# EAGLE design op-synth 1.0 (EAGLE 6.6.0)
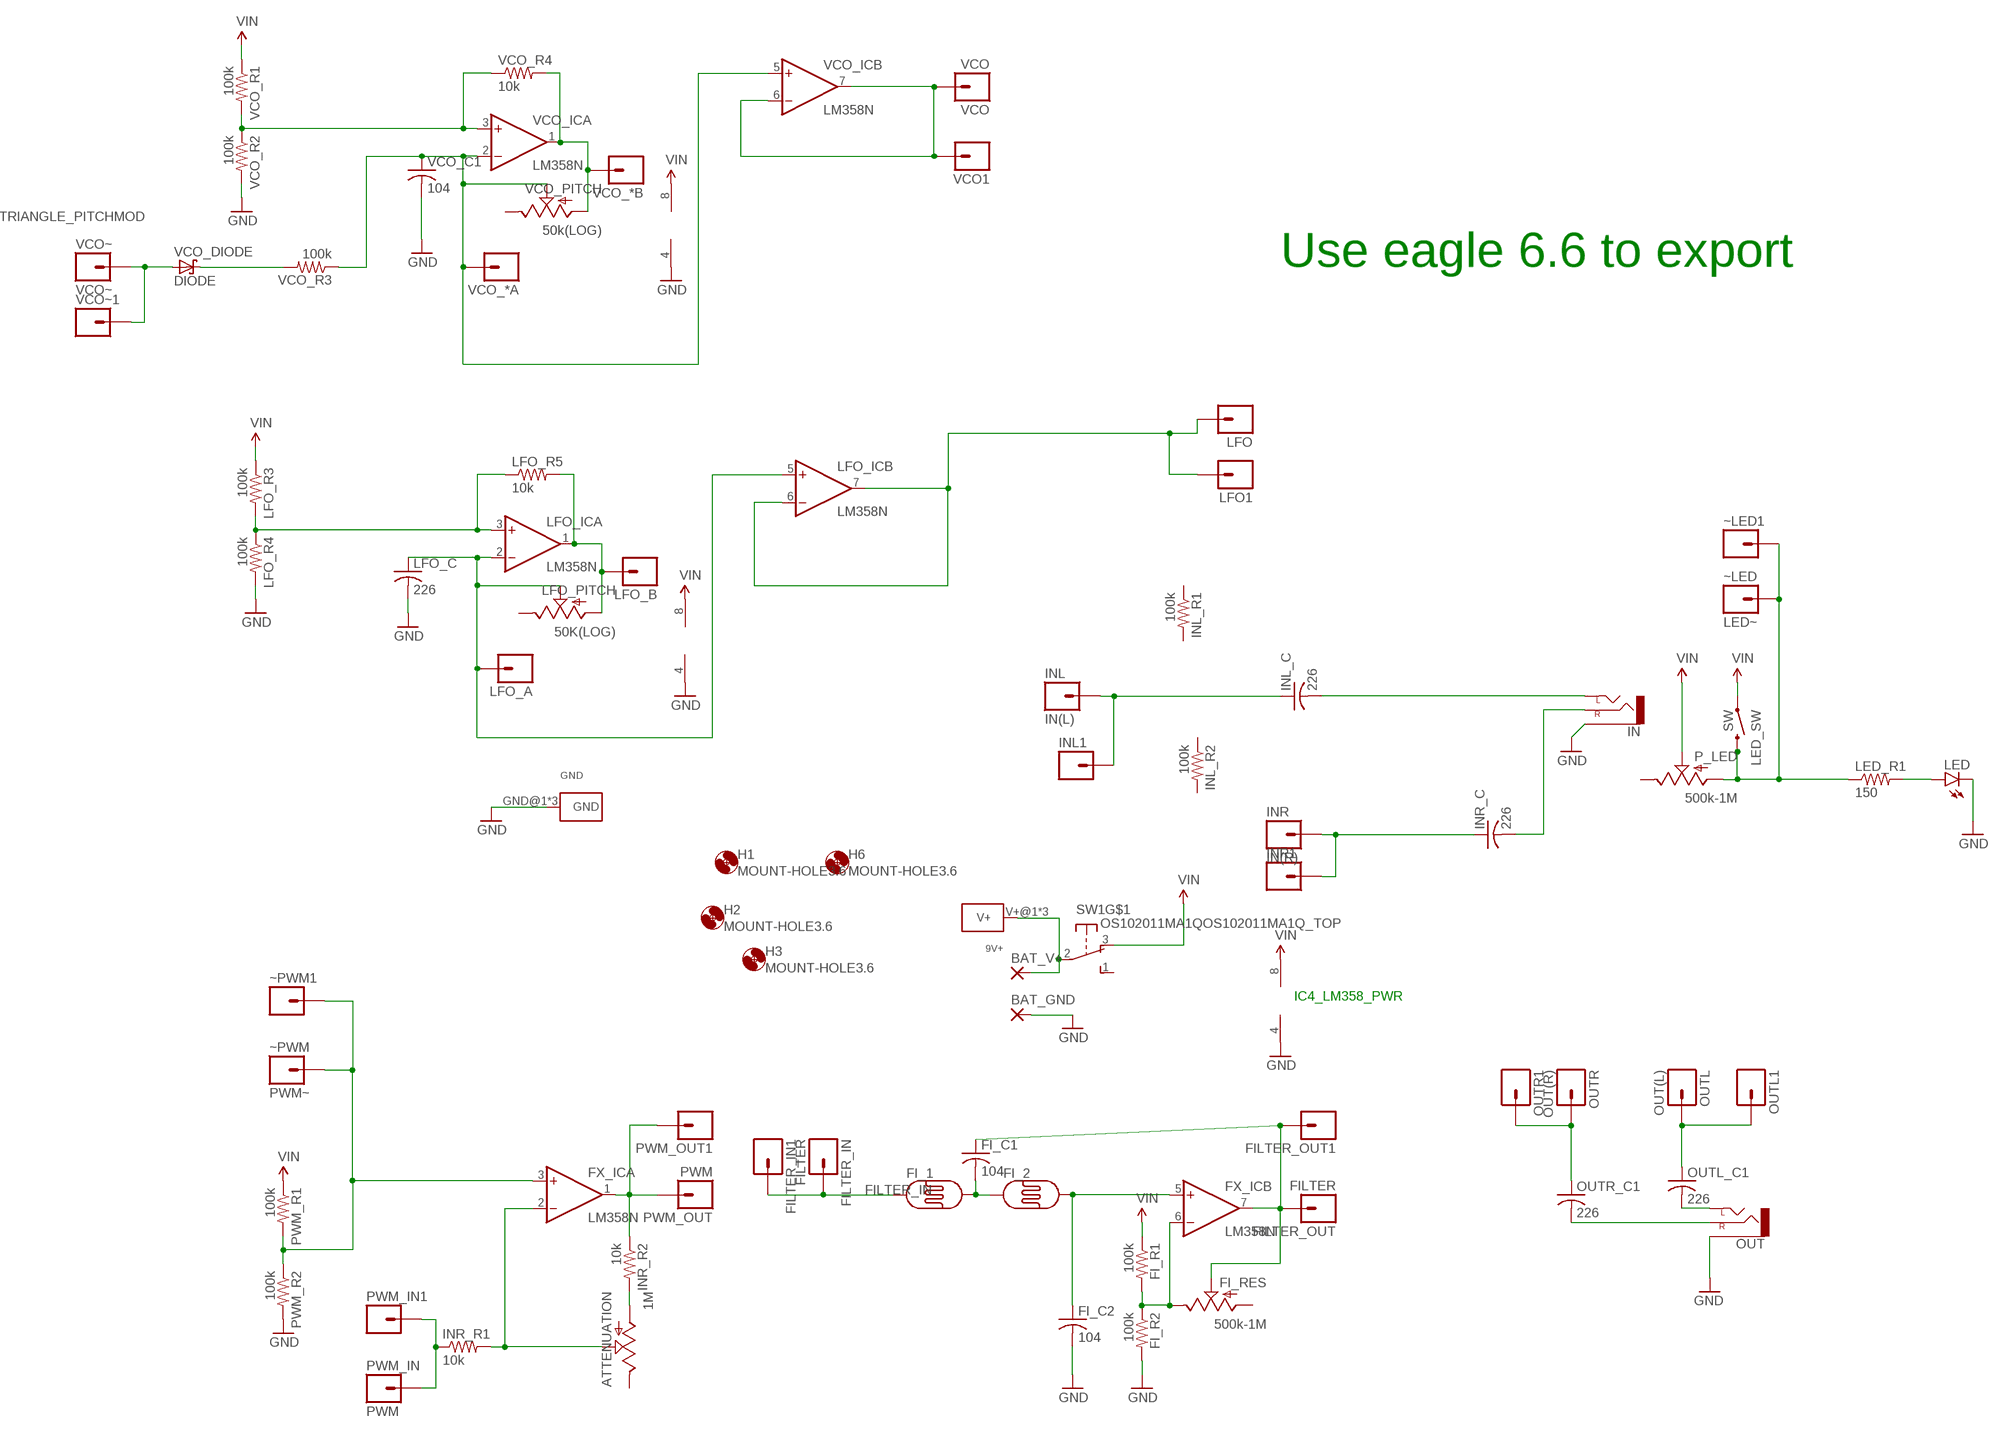
[diagram p0: schematic, sheet 1]

## Parts
9V+  KEYSTONE-629+  [KEYSTONE_BATTAERY_TERMINAL-629+]
ATTENUATION  1M  POTTRIM  [TRIM_POT]
BAT_GND  3,81/1,4  [3,81/1,4]
BAT_V+  3,81/1,4  [3,81/1,4]
FI_1  PHOTOCELLPTH  [PHOTOCELL]
FI_2  PHOTOCELLPTH  [PHOTOCELL]
FI_C1  104  C-US050-024X044  [C050-024X044]
FI_C2  104  C-US050-024X044  [C050-024X044]
FI_R1  100k  R-US_0204/7  [0204/7]
FI_R2  100k  R-US_0204/7  [0204/7]
FI_RES  500k-1M  POT  [ALPS_POT]
FILTER_IN  FILTER  HEADER-1X1  [1X01_SIDE_NAME]
FILTER_IN1  HEADER-1X1  [1X01_SIDE_NAME]
FILTER_OUT  FILTER  HEADER-1X1  [1X01_SIDE_NAME]
FILTER_OUT1  HEADER-1X1  [1X01_SIDE_NAME]
FX_IC  LM358N  [DIL08]
GND  KEYSTONE-629  [KEYSTONE_AA_AAA_BATTERY_TERMINAL-629]
H1  MOUNT-HOLE3.6  [3,6]
H2  MOUNT-HOLE3.6  [3,6]
H3  MOUNT-HOLE3.6  [3,6]
H6  MOUNT-HOLE3.6  [3,6]
IN  AUDIO-JACKPTH  [AUDIO-JACK]
INL  IN(L)  HEADER-1X1  [1X01_SIDE_NAME]
INL1  HEADER-1X1  [1X01_SIDE_NAME]
INL_C  226  C-US050-024X044  [C050-024X044]
INL_R1  100k  R-US_0204/7  [0204/7]
INL_R2  100k  R-US_0204/7  [0204/7]
INR  IN(R)  HEADER-1X1  [1X01_SIDE_NAME]
INR1  HEADER-1X1  [1X01_SIDE_NAME]
INR_C  226  C-US050-024X044  [C050-024X044]
INR_R1  10k  R-US_0204/7  [0204/7]
INR_R2  10k  R-US_0204/7  [0204/7]
LED  LED5MM  [LED5MM]
LED_R1  150  R-US_0204/7  [0204/7]
LED_SW  SW  SWITCH-MOMENTARY-212MM  [TACTILE-PTH-12MM]
LFO  HEADER-1X1  [1X01_SIDE_NAME]
LFO1  HEADER-1X1  [1X01_SIDE_NAME]
LFO_A  HEADER-1X1  [1X01_SIDE_NAME]
LFO_B  HEADER-1X1  [1X01_SIDE_NAME]
LFO_C  226  C-US050-024X044  [C050-024X044]
LFO_IC  LM358N  [DIL08]
LFO_PITCH  50K(LOG)  POT  [ALPS_POT]
LFO_R3  100k  R-US_0204/7  [0204/7]
LFO_R4  100k  R-US_0204/7  [0204/7]
LFO_R5  10k  R-US_0204/7  [0204/7]
OUT  AUDIO-JACKPTH  [AUDIO-JACK]
OUTL  OUT(L)  HEADER-1X1  [1X01_SIDE_NAME]
OUTL1  HEADER-1X1  [1X01_SIDE_NAME]
OUTL_C1  226  C-US050-024X044  [C050-024X044]
OUTR  OUT(R)  HEADER-1X1  [1X01_SIDE_NAME]
OUTR1  HEADER-1X1  [1X01_SIDE_NAME]
OUTR_C1  226  C-US050-024X044  [C050-024X044]
P_LED  500k-1M  POT  [ALPS_POT]
PWM_IN  PWM  HEADER-1X1  [1X01_SIDE_NAME]
PWM_IN1  HEADER-1X1  [1X01_SIDE_NAME]
PWM_OUT  PWM  HEADER-1X1  [1X01_SIDE_NAME]
PWM_OUT1  HEADER-1X1  [1X01_SIDE_NAME]
PWM_R1  100k  R-US_0204/7  [0204/7]
PWM_R2  100k  R-US_0204/7  [0204/7]
SW1  OS102011MA1QOS102011MA1Q_TOP  [OS102011MA1Q]
VCO  VCO  HEADER-1X1  [1X01_SIDE_NAME]
VCO1  HEADER-1X1  [1X01_SIDE_NAME]
VCO_*A  HEADER-1X1  [1X01_SIDE_NAME]
VCO_*B  HEADER-1X1  [1X01_SIDE_NAME]
VCO_C1  104  C-US050-024X044  [C050-024X044]
VCO_DIODE  DIODE  SCHOTTKY-DIODEDO41-7  [DO41-7]
VCO_IC  LM358N  [DIL08]
VCO_PITCH  50k(LOG)  POT  [ALPS_POT]
VCO_R1  100k  R-US_0204/7  [0204/7]
VCO_R2  100k  R-US_0204/7  [0204/7]
VCO_R3  100k  R-US_0204/7  [0204/7]
VCO_R4  10k  R-US_0204/7  [0204/7]
VCO~  VCO~  HEADER-1X1  [1X01_SIDE_NAME]
VCO~1  HEADER-1X1  [1X01_SIDE_NAME]
~LED  LED~  HEADER-1X1  [1X01_SIDE_NAME]
~LED1  HEADER-1X1  [1X01_SIDE_NAME]
~PWM  PWM~  HEADER-1X1  [1X01_SIDE_NAME]
~PWM1  HEADER-1X1  [1X01_SIDE_NAME]

## Nets
FILTER_IN: FI_1.1 FILTER_IN1.1 FILTER_IN.1
FILTER_OUT: FI_C1.1 FI_RES.P$2(S) FILTER_OUT1.1 FILTER_OUT.1 FX_IC.7(B:OUT)
GND: BAT_GND.1(P) FI_C2.2 FI_R2.2 FX_IC.4(P:V-) GND.GND@1(GND) GND.GND@2(GND) GND.GND@3(GND) IN.SLEEVE LED.K(C) LFO_C.2 LFO_IC.4(P:V-) LFO_R4.2 OUT.SLEEVE PWM_R2.2 VCO_C1.2 VCO_IC.4(P:V-) VCO_R2.2
LFO: LFO1.1 LFO.1 LFO_IC.6(B:-IN) LFO_IC.7(B:OUT)
MOD_IN: INR_R1.1 PWM_IN1.1 PWM_IN.1
N$1: 9V+.V+@1(V+) 9V+.V+@2(V+) 9V+.V+@3(V+) BAT_V+.1(P) SW1.2(P)
N$2: VCO_DIODE.C VCO_R3.2
N$3: ATTENUATION.3(A) INR_R2.2
N$4: VCO_IC.3(A:+IN) VCO_R1.2 VCO_R2.1 VCO_R4.1
N$5: FX_IC.3(A:+IN) PWM_R1.2 PWM_R2.1 ~PWM1.1 ~PWM.1
N$6: LED.A LED_R1.2
N$7: FI_2.2 FI_C2.1 FX_IC.5(B:+IN)
N$8: FI_1.2 FI_2.1 FI_C1.2
N$9: OUTR1.1 OUTR.1 OUTR_C1.1
N$10: VCO_*B.1 VCO_IC.1(A:OUT) VCO_PITCH.P$3(A) VCO_R4.2
N$11: OUT.TIP(LEFT) OUTL_C1.2
N$12: OUTL1.1 OUTL.1 OUTL_C1.1
N$13: LED_R1.1 LED_SW.3 P_LED.P$3(A) ~LED1.1 ~LED.1
N$14: INR1.1 INR.1 INR_C.1
N$15: IN.RING(RIGHT) INR_C.2
N$16: FI_R1.2 FI_R2.1 FI_RES.P$1(E) FX_IC.6(B:-IN)
N$17: LFO_IC.3(A:+IN) LFO_R3.2 LFO_R4.1 LFO_R5.1
N$18: VCO_*A.1 VCO_C1.1 VCO_IC.2(A:-IN) VCO_IC.5(B:+IN) VCO_PITCH.P$2(S) VCO_R3.1
N$19: INL1.1 INL.1 INL_C.1
N$20: IN.TIP(LEFT) INL_C.2
N$21: LFO_B.1 LFO_IC.1(A:OUT) LFO_PITCH.P$3(A) LFO_R5.2
N$22: LFO_A.1 LFO_C.1 LFO_IC.2(A:-IN) LFO_IC.5(B:+IN) LFO_PITCH.P$2(S)
N$23: VCO1.1 VCO.1 VCO_IC.6(B:-IN) VCO_IC.7(B:OUT)
N$24: OUT.RING(RIGHT) OUTR_C1.2
N$25: ATTENUATION.1(S) FX_IC.2(A:-IN) INR_R1.2
N$26: FX_IC.1(A:OUT) INR_R2.1 PWM_OUT1.1 PWM_OUT.1
TRIANGLE_PITCHMOD: VCO_DIODE.A VCO~1.1 VCO~.1
VIN: FI_R1.1 FX_IC.8(P:V+) LED_SW.1 LFO_IC.8(P:V+) LFO_R3.1 P_LED.P$2(S) PWM_R1.1 SW1.3(O) VCO_IC.8(P:V+) VCO_R1.1
Unconnected: ATTENUATION.2(E) FI_RES.P$3(A) INL_R1.1 INL_R1.2 INL_R2.1 INL_R2.2 LFO_PITCH.P$1(E) P_LED.P$1(E) SW1.1(S) SW1.MT1(MT) SW1.MT2(MT) VCO_PITCH.P$1(E)

## Notes on the sheet
- Use eagle 6.6 to export
- IC4_LM358_PWR

## Library data of the parts
9V+ = kanflo:KEYSTONE-629+
ATTENUATION = SparkFun-Electromechanical:POT
BAT_GND BAT_V+ = wirepad:3,81/1,4: THROUGH-HOLE PAD
FI_1 FI_2 = SparkFun-Sensors:PHOTOCELL: CdS photoresistor. This is a low cost way to detect light levels. Resistance decreases with more incoming light. SparkFun SKU: SEN-09088
FI_C1 FI_C2 LFO_C = resistor:C-US: CAPACITOR, American symbol
FI_R1 FI_R2 INL_R1 INL_R2 INR_R1 INR_R2 LED_R1 LFO_R3-LFO_R5 PWM_R1 PWM_R2 VCO_R1-VCO_R4 = resistor:R-US_: RESISTOR, American symbol
FI_RES LFO_PITCH P_LED VCO_PITCH = SparkFun-Electromechanical:POT; PROD_ID: RES-09177
FILTER_IN FILTER_IN1 FILTER_OUT FILTER_OUT1 INL INL1 INR INR1 LFO LFO1 LFO_A LFO_B OUTL OUTL1 OUTR OUTR1 PWM_IN PWM_IN1 PWM_OUT PWM_OUT1 VCO VCO1 VCO_*A VCO_*B VCO~ VCO~1 ~LED ~LED1 ~PWM ~PWM1 = TOF:HEADER-1X1: Header 1 Standard 1-pin 0.1" header. Use with straight break away headers (SKU : PRT-00116), right angle break away headers (PRT-00553), swiss pins (PRT-00743), machine pins (PRT-00117), and female headers (PRT-00115).
FX_IC LFO_IC VCO_IC = linear:LM358: OP AMP also LM158; LM258; LM2904 Source: http://cache.national.com/ds/LM/LM158.pdf
GND = kanflo:KEYSTONE-629: Keystone 629 PCB Mount Battery Contact for 1 (AA), 1 (AAA), 1 (N), Coil Spring Contact Links Data sheet <http://docs-europe.electrocomponents.com/webdocs/002e/0900766b8002ef6f.pdf> RS Online <http://se.rs-online.com/web/p/battery-holders-mounts/2050057/>
H1-H3 H6 = holes:MOUNT-HOLE: MOUNTING HOLE with drill center marker
IN OUT = SparkFun-Connectors:AUDIO-JACK: 3.5mm Audio Jack Simple 3.5mm common PCB mount audio jack. Variant PTH is our storefront SKU PRT-08032
INL_C INR_C OUTL_C1 OUTR_C1 VCO_C1 = adafruit:C-US: CAPACITOR, American symbol
LED = SparkFun-LED:LED: LEDs Standard schematic elements and footprints for 5mm, 3mm, 1206, and 0603 sized LEDs. 5mm - Spark Fun Electronics SKU : COM-00529 (and others)
LED_SW = SparkFun-Electromechanical:SWITCH-MOMENTARY-2: Various NO switches- pushbuttons, reed, etc; PROD_ID: SWCH-09185
SW1 = TOF:OS102011MA1Q: OS10201MA1Q through-hole right angle switch http://www.ladyada.net/library/eagle
VCO_DIODE = adafruit:SCHOTTKY-DIODE: Schottky Diode

## Board
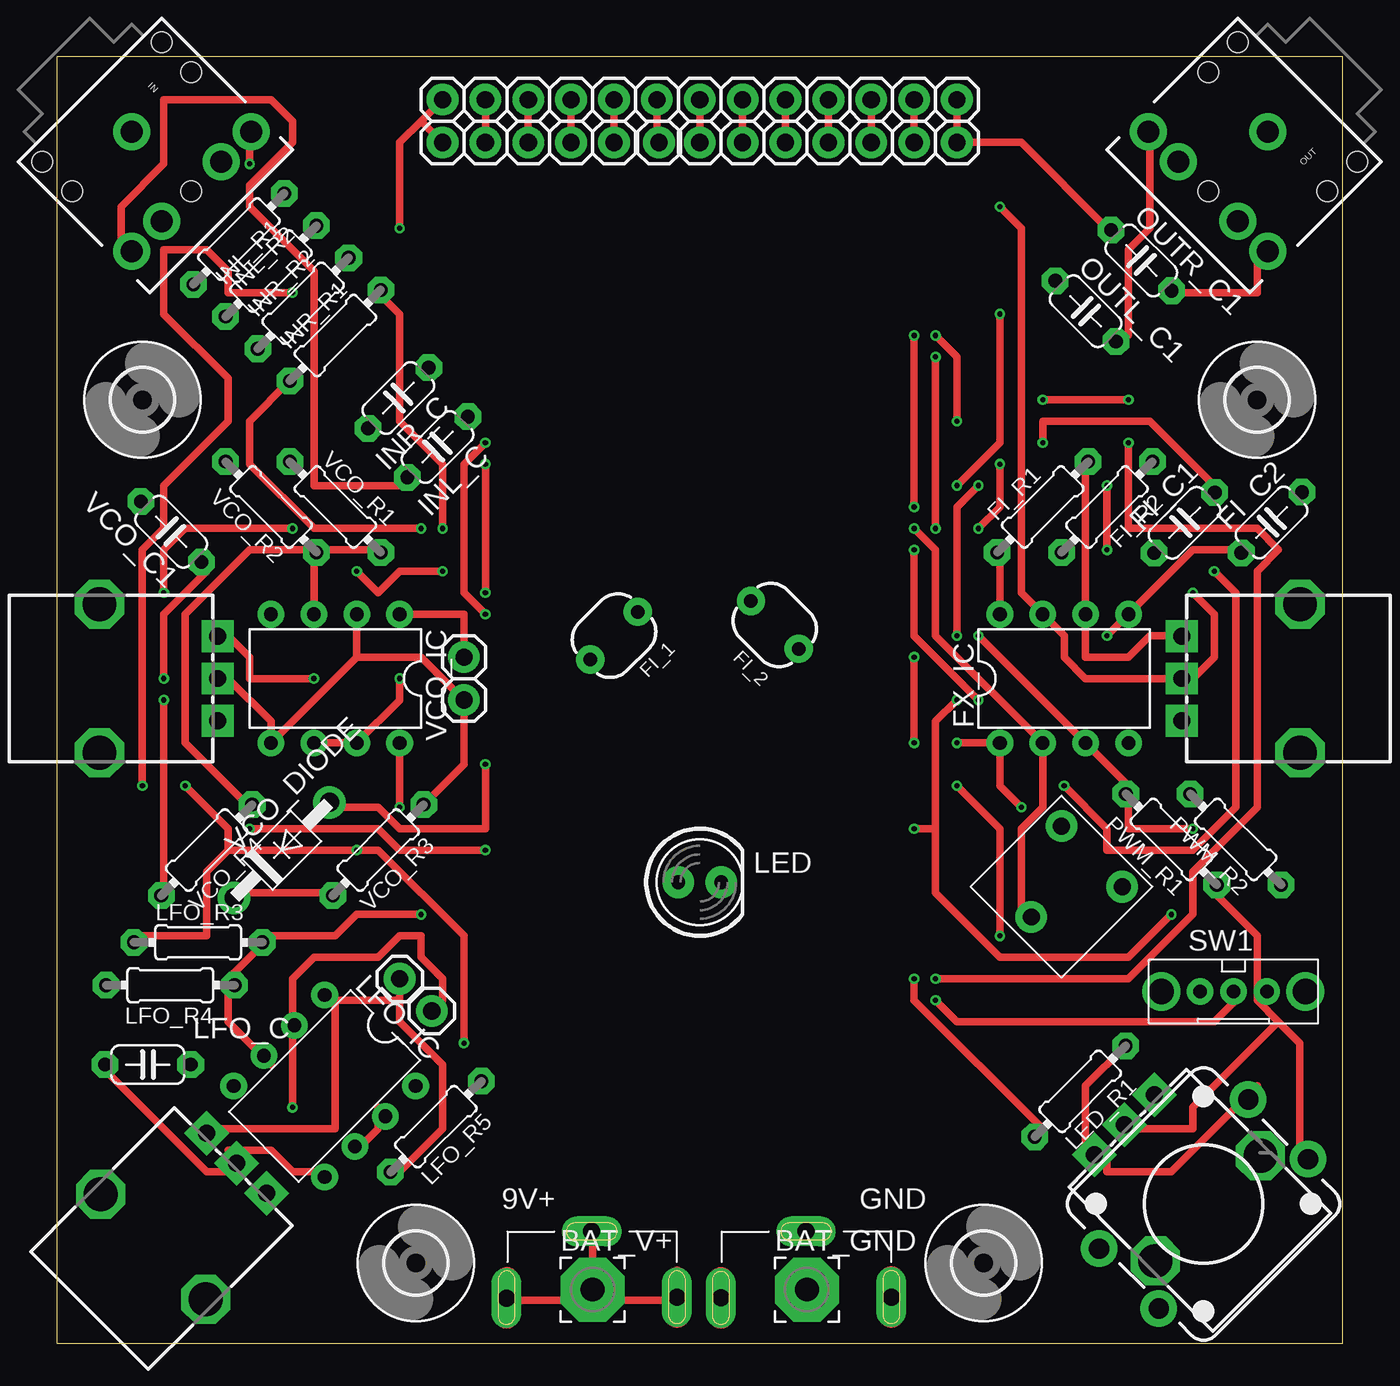
[diagram p1: board, top side]
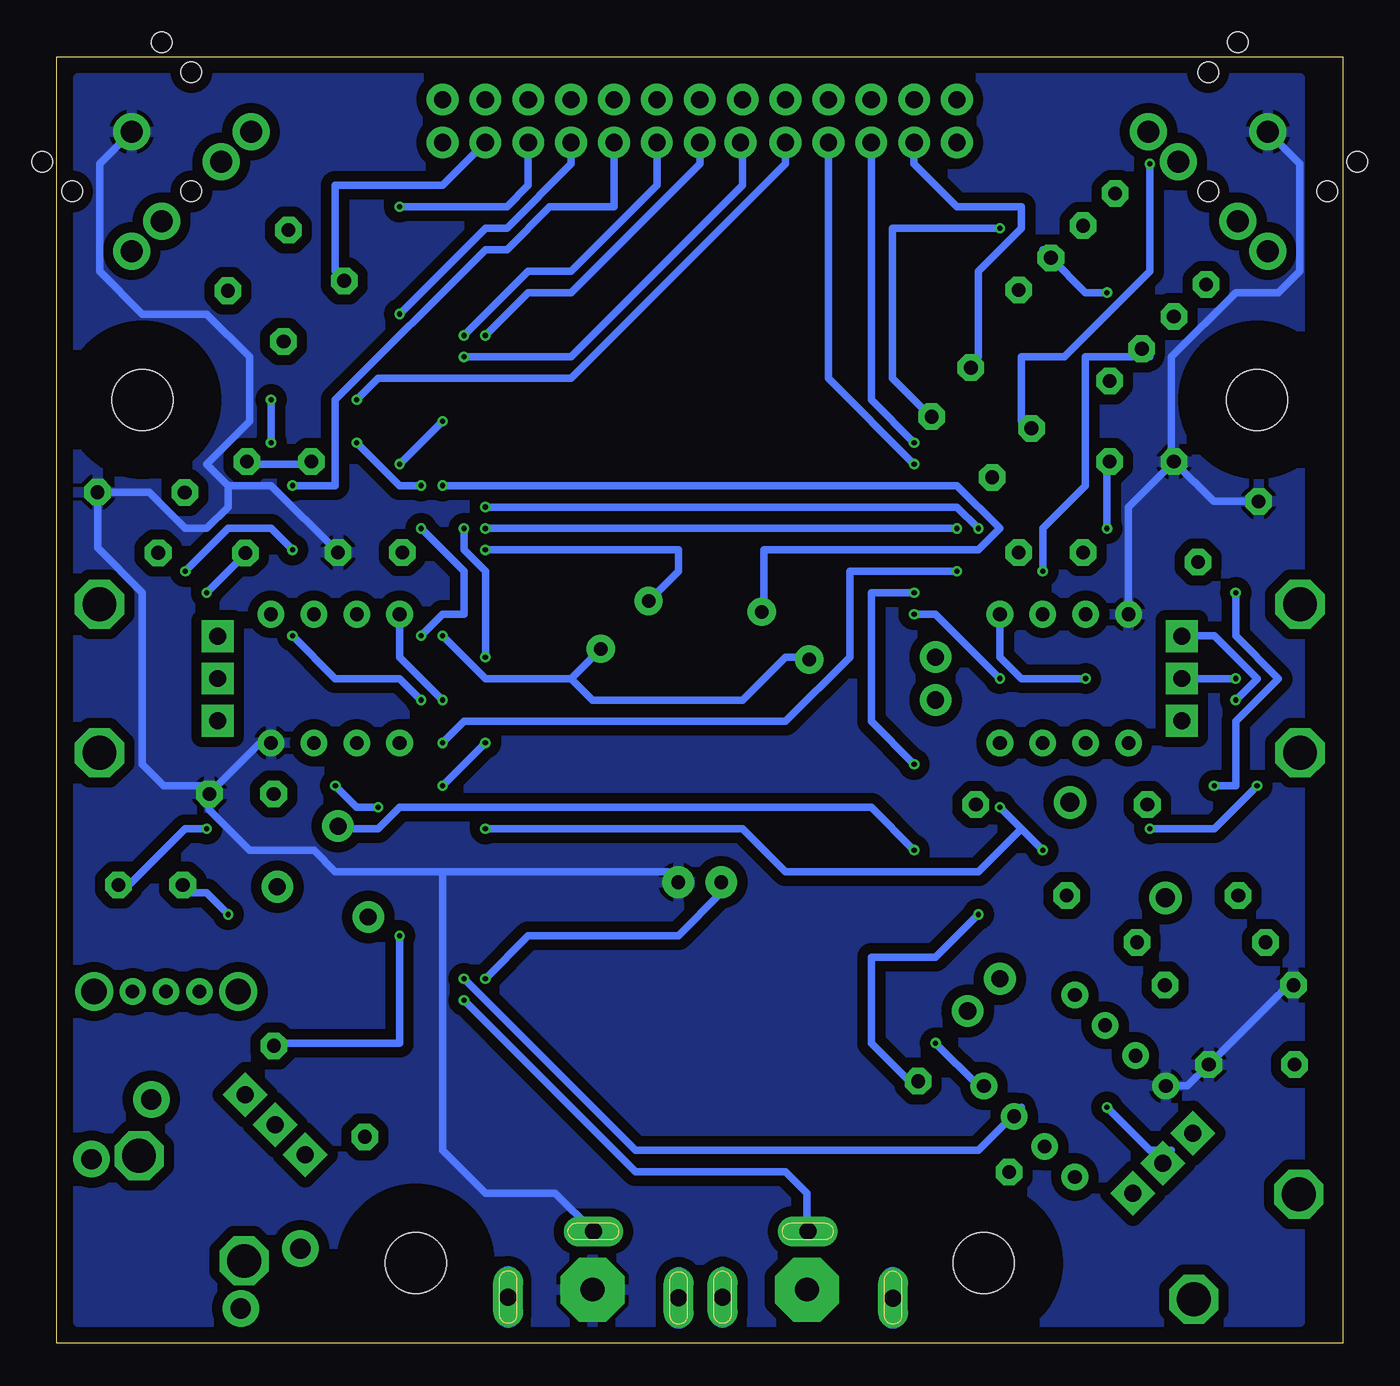
[diagram p2: board, bottom side, seen from below]

Size 76.2 x 76.2 mm. Coordinates in mm from the lower left corner, seen from the top.
Outline: 0,0 76.2,0 76.2,76.2 0,76.2 0,0
Copper layers (1*16): Top 0.035mm / dielectric 1.5mm / Bottom 0.035mm
Design rules "EagleRules *": minimum track width 18mil, minimum drill 12mil, track to track 7mil, track to pad 12mil, pad to pad 12mil, via to via 7mil, smd to smd 0mil, copper to edge 25mil, drill to drill 10mil, minimum pad ring 15mil, minimum via ring 6mil, stop-mask expansion 2mil, vias tented up to drill 25mil, thermal gap 10mil
tRestrict: area 21.6,61 to 54.6,69.8; area 26.7,7.6 to 50.2,61

### Footprints (pad centres in the part's own frame; a part is rotated, then mirrored left to right if it is on the bottom)
KEYSTONE_BATTAERY_TERMINAL-629+ = drill 1 pad 1.5 long: V+@1 5,-0.449; V+@2 -0.05,3.45; V+@3 -5.1,-0.499
TRIM_POT = drill 1 pad 1.88: 1 5.08,0; 2 0,2.54; 3 0,-2.54
3,81/1,4 = drill 1.397 pad 3.81 octagon: 1 0,0
PHOTOCELL = drill 0.8 pad 1.676: 1 -2,0; 2 2,0
C050-024X044 = drill 0.813 octagon: 1 -2.54,0; 2 2.54,0
0204/7 = drill 0.813 octagon: 1 -3.81,0; 2 3.81,0
ALPS_POT = drill 1 pad 1.88 square: P$1 7,-2.5; P$2 7,0; P$3 7,2.5 | drill 2 octagon: P$4 0,-4.4; P$5 0,4.4
1X01_SIDE_NAME = drill 1.016 pad 1.88: 1 0,0
DIL08 = drill 0.813 pad 1.27: 1 -3.81,-3.81; 2 -1.27,-3.81; 3 1.27,-3.81; 4 3.81,-3.81; 5 3.81,3.81; 6 1.27,3.81; 7 -1.27,3.81; 8 -3.81,3.81
KEYSTONE_AA_AAA_BATTERY_TERMINAL-629 = drill 1 pad 1.5 long: GND@1 5,-0.436; GND@2 -0.05,3.45; GND@3 -5.1,-0.486
3,6 = hole 3.6: 0,0
AUDIO-JACK = drill 1.3 pad 2.184: RING 5,5; RSH 5,2.5; SLEEVE 0,0; TIP 5,-5; TSH 5,-2.5 | hole 1.2: 0,5; -2.5,5; -2.5,-5; 0,-5; 5,0
LED5MM = drill 0.813 pad 1.88: A -1.27,0; K 1.27,0
TACTILE-PTH-12MM = drill 1.2 pad 2.159: 1 6.25,-2.5; 2 -6.25,-2.5; 3 6.25,2.5; 4 -6.25,2.5
OS102011MA1Q = drill 0.8 pad 1.422: 1 -1.981,0; 2 0,0; 3 1.981,0 | drill 1.5 pad 2.184: MT1 -4.267,0; MT2 4.267,0
DO41-7 = drill 1.118 pad 1.93: A 4,0; C -4,0

### Placement (x,y rotation side)
9V+  31.75,3.17 0 top
ATTENUATION  61.33,28.84 225 top
BAT_GND  44.45,3.17 0 top
BAT_V+  31.75,3.17 0 top
FI_1  33.02,41.91 225 top
FI_2  42.55,42.55 135 top
FI_C1  66.82,48.59 45 top
FI_C2  71.98,48.61 45 top
FI_R1  58.42,49.53 45 top
FI_R2  62.23,49.53 225 top
FI_RES  73.66,39.37 180 top
FILTER_IN  45.72,71.12 270 top
FILTER_IN1  45.72,73.66 90 top
FILTER_OUT  48.26,71.12 270 top
FILTER_OUT1  48.26,73.66 90 top
FX_IC  59.69,39.37 0 top
GND  44.45,3.17 0 top
H1  71.12,55.88 0 top
H2  21.27,4.76 0 top
H3  54.93,4.76 0 top
H6  5.08,55.88 0 top
IN  4.45,71.75 315 top
INL  22.86,71.12 270 top
INL1  22.86,73.66 90 top
INL_C  22.56,53.09 225 top
INL_R1  12.7,63.5 45 top
INL_R2  10.79,65.41 225 top
INR  25.4,71.12 270 top
INR1  25.4,73.66 90 top
INR_C  20.24,55.99 225 top
INR_R1  16.51,59.69 45 top
INR_R2  14.61,61.59 45 top
LED  38.1,27.3 0 top
LED_R1  60.64,14.92 225 top
LED_SW  67.94,8.26 45 top
LFO  33.02,71.12 270 top
LFO1  33.02,73.66 0 top
LFO_A  22.23,19.68 45 top
LFO_B  20.32,21.59 315 top
LFO_C  5.4,16.51 0 top
LFO_IC  15.88,15.24 225 top
LFO_PITCH  5.71,5.71 45 top
LFO_R3  8.38,23.75 0 top
LFO_R4  6.73,21.21 180 top
LFO_R5  22.47,12.83 225 top
OUT  71.75,71.75 225 top
OUTL  50.8,71.12 270 top
OUTL1  50.8,73.66 90 top
OUTL_C1  60.96,61.13 315 top
OUTR  53.34,71.12 270 top
OUTR1  53.34,73.66 90 top
OUTR_C1  64.26,64.13 315 top
P_LED  68.21,7.99 135 top
PWM_IN  38.1,71.12 270 top
PWM_IN1  38.1,73.66 90 top
PWM_OUT  43.18,71.12 270 top
PWM_OUT1  43.18,73.66 90 top
PWM_R1  66.04,29.84 135 top
PWM_R2  69.85,29.84 135 top
SW1  69.72,20.83 0 top
VCO  27.94,71.12 270 top
VCO1  27.94,73.66 90 top
VCO_*A  24.13,38.1 0 top
VCO_*B  24.13,40.64 270 top
VCO_C1  6.78,48.07 135 top
VCO_DIODE  13.34,29.21 45 top
VCO_IC  16.51,39.37 180 top
VCO_PITCH  2.54,39.37 0 top
VCO_R1  16.51,49.53 315 top
VCO_R2  12.7,49.53 135 top
VCO_R3  19.05,29.21 225 top
VCO_R4  8.89,29.21 225 top
VCO~  30.48,71.12 270 top
VCO~1  30.48,73.66 90 top
~LED  35.69,71.12 270 top
~LED1  35.56,73.66 90 top
~PWM  40.64,71.12 270 top
~PWM1  40.64,73.66 90 top

### Tracks (layer width: path | path; a pad name or v marks a point on that pad's centre or on a via)
FILTER_IN  (via drill 0.3)
  Top 0.457: v53.34,50.8 55.88,53.34 v55.88,60.96 | FILTER_IN.1 FILTER_IN1.1
  Bottom 0.457: v53.34,50.8 22.86,50.8 20.32,48.26 21.59,46.99 34.29,46.99 34.29,43.18 FI_1.1 | v55.88,60.96 50.8,66.04 49.53,66.04 45.72,69.85 FILTER_IN.1
FILTER_OUT  (via drill 0.3)
  Top 0.457: FILTER_OUT1.1 FILTER_OUT.1 | v67.31,44.45 68.58,43.18 68.58,40.64 67.31,39.37 FI_RES.P$2 60.96,39.37 59.69,40.64 59.69,41.91 FX_IC.7 57.15,44.45 57.15,66.04 v55.88,67.31
  Bottom 0.457: v67.31,44.45 64.77,46.99 FI_C1.1 | FILTER_OUT.1 48.26,68.58 49.53,67.31 v55.88,67.31
GND
  Bottom 0.457: IN.SLEEVE 2.54,69.85 2.54,63.5 3.81,62.23 6.35,62.23 10.16,58.42 10.16,52.38 VCO_R2.2 | VCO_R2.2 7.64,49.86 VCO_C1.2 | VCO_IC.4 12.7,49.53 VCO_R2.2 | VCO_R2.2 | OUT.SLEEVE 73.66,69.85 73.66,63.5 71.12,60.96 67.31,60.96 64.77,58.42 64.77,54.61 67.31,52.07 66.04,50.8 | 66.04,50.8 66.04,49.53 67.31,48.26 68.58,48.26 70.73,50.41 FI_C2.2 73.78,47.11 71.12,44.45 71.12,34.29 69.85,33.02 67.64,33.02 PWM_R2.2 | FI_R2.2 63.5,50.8 66.04,50.8 | PWM_R2.2 64.14,35.56 FX_IC.4 | LED.K 40.01,27.94 53.34,27.94 | 53.34,27.94 59.69,27.94 60.96,29.21 64.77,29.21 67.16,31.6 PWM_R2.2 | GND.GND@2 46.66,8.89 50.8,8.89 53.34,11.43 53.34,27.94 | LFO_IC.4 9.21,15.24 LFO_C.2 3.24,21.21 LFO_R4.2
  pour Bottom (isolate 0.61): 2.54,74.93 74.93,74.93 74.93,1.27 2.54,1.27
LFO  (via drill 0.3)
  Top 0.457: LFO_IC.6 17.78,11.43 19.05,12.7 19.05,13.97 LFO_IC.7 | LFO1.1 LFO.1 | v52.07,21.59 63.5,21.59 67.31,25.4 67.31,27.94 71.12,31.75 71.12,45.72 72.39,46.99 71.12,48.26 63.5,48.26 v63.5,53.34 | v58.42,55.88 v63.5,55.88
  Bottom 0.457: v52.07,21.59 41.91,11.43 21.59,11.43 19.05,13.97 LFO_IC.7 | v63.5,55.88 v63.5,53.34 | v58.42,55.88 57.15,57.15 45.72,57.15 33.02,69.85 LFO.1
MOD_IN  (via drill 0.3)
  Top 0.457: v21.59,48.26 15.24,48.26 11.43,52.07 11.43,54.61 INR_R1.1 13.97,57.15 | v50.8,59.69 v50.8,49.53 | PWM_IN.1 PWM_IN1.1
  Bottom 0.457: v21.59,48.26 22.86,49.53 v50.8,49.53 | v50.8,59.69 48.26,62.23 45.72,62.23 38.1,69.85 PWM_IN.1
N$1  (via drill 0.3)
  Top 0.457: 31.75,2.54 26.67,2.54 9V+.V+@3 | 31.75,2.54 36.83,2.54 9V+.V+@1 | 31.75,2.54 BAT_V+.1 31.75,6.35 9V+.V+@2 | v52.07,20.32 53.34,19.05 68.58,19.05 69.85,20.32 SW1.2
  Bottom 0.457: v52.07,20.32 41.91,10.16 33.02,10.16 31.75,8.89 31.75,6.35 9V+.V+@2
N$2
  Top 0.457: VCO_R3.2 16.51,26.67 11.43,26.67 VCO_DIODE.C
N$3  (via drill 0.3)
  Top 0.457: v13.97,62.23 10.16,62.23 10.16,63.5 8.89,64.77 6.35,64.77 6.35,60.96 10.16,57.15 10.16,54.61 6.35,50.8 6.35,48.26 5.08,46.99 v5.08,33.02 | v11.43,30.48 19.05,30.48 20.32,29.21 v25.4,29.21
  Bottom 0.457: v13.97,62.23 15.24,62.23 INR_R2.2 17.78,64.77 | v5.08,33.02 7.62,30.48 v11.43,30.48 | v25.4,29.21 27.94,31.75 55.88,31.75 57.15,30.48 59.69,30.48 ATTENUATION.3
N$4
  Top 0.457: 15.24,46.99 11.43,46.99 7.62,43.18 7.62,35.56 11.43,31.75 VCO_R4.1 | 15.24,46.99 VCO_IC.3 | 15.24,46.99 19.05,46.99 VCO_R1.2 | 15.24,46.99 VCO_R2.1
N$5  (via drill 0.3)
  Top 0.457: ~PWM1.1 ~PWM.1 | 63.5,33.02 FX_IC.3 v54.61,41.91 | v67.31,30.48 63.5,30.48 63.5,33.02 | 63.5,33.02 PWM_R1.2 | v52.07,59.69 53.34,58.42 v53.34,54.61 | v55.88,52.07 55.88,49.53 v54.61,48.26
  Bottom 0.457: v67.31,30.48 68.58,30.48 72.39,26.67 PWM_R2.1 | ~PWM.1 40.64,68.58 45.72,63.5 48.26,63.5 v52.07,59.69 | v55.88,52.07 v53.34,54.61 | v54.61,48.26 52.07,45.72 52.07,43.18 53.34,43.18 v54.61,41.91
N$6  (via drill 0.3)
  Top 0.457: v50.8,21.59 50.8,20.32 58.42,12.7 LED_R1.2
  Bottom 0.457: v50.8,21.59 48.26,24.13 39.37,24.13 36.83,26.67 LED.A
N$7  (via drill 0.3)
  Top 0.457: FI_C2.1 69.85,46.99 67.31,46.99 FX_IC.5 v62.23,41.91 | v50.8,46.99 50.8,41.91 v54.61,38.1
  Bottom 0.457: v50.8,46.99 39.37,46.99 39.37,45.72 40.64,44.45 FI_2.2 | v54.61,38.1 55.88,39.37 59.69,39.37 v62.23,41.91
N$8  (via drill 0.3)
  Top 0.457: v58.42,53.34 58.42,54.61 64.77,54.61 68.58,50.8 FI_C1.2 | v54.61,50.8 53.34,49.53 v53.34,41.91
  Bottom 0.457: v58.42,53.34 55.88,50.8 v54.61,50.8 | v53.34,41.91 50.8,39.37 45.72,39.37 | 45.72,39.37 44.45,40.64 FI_2.1 | 45.72,39.37 44.45,38.1 35.56,38.1 33.02,40.64 31.75,40.64 FI_1.2
N$9
  Top 0.457: OUTR_C1.1 62.23,66.04 57.15,71.12 OUTR.1 OUTR1.1
N$10  (via drill 0.3)
  Top 0.457: VCO_IC.1 24.13,43.18 VCO_*B.1 | v6.35,38.1 6.35,26.67 VCO_R4.2 | v15.24,39.37 11.43,39.37 11.43,40.64 10.16,41.91 VCO_PITCH.P$3
  Bottom 0.457: v6.35,38.1 5.08,39.37 7.62,41.91 8.89,41.91 VCO_PITCH.P$3 | VCO_IC.1 20.32,40.64 19.05,39.37 v15.24,39.37
N$11
  Top 0.457: OUTL_C1.2 63.5,59.69 63.5,64.77 64.77,66.04 64.77,71.12 OUT.TIP
N$12
  Top 0.457: OUTL.1 OUTL1.1
  Bottom 0.457: OUTL.1 53.34,68.58 59.69,68.58 59.69,63.5 OUTL_C1.1
N$13  (via drill 0.3)
  Top 0.457: ~LED1.1 35.56,71.12 ~LED.1 | 71.12,15.24 LED_SW.3 69.85,13.97 66.04,10.16 62.23,10.16 62.23,11.43 P_LED.P$3 60.96,11.43 60.96,15.24 LED_R1.1 63.5,17.78 | v52.07,48.26 v52.07,58.42 | v50.8,35.56 v50.8,40.64 | v53.34,33.02 55.88,30.48 v55.88,24.13
  Bottom 0.457: v52.07,58.42 45.72,58.42 35.56,68.58 35.56,71.12 ~LED.1 | v52.07,48.26 52.07,46.99 50.8,45.72 v50.8,40.64 | v53.34,33.02 v50.8,35.56 | v55.88,24.13 55.88,17.78 63.5,17.78 LED_R1.1
N$14
  Top 0.457: INR.1 INR1.1
  Bottom 0.457: INR.1 25.4,69.85 22.86,67.31 19.05,67.31 19.05,66.04 21.59,63.5 21.59,58.42 INR_C.1
N$15  (via drill 0.3)
  Top 0.457: v11.43,69.85 11.43,71.12 IN.RING
  Bottom 0.457: v11.43,69.85 11.43,63.5 16.51,58.42 19.05,58.42 19.05,54.61 INR_C.2
N$16
  Top 0.457: FI_R1.2 60.96,52.07 FX_IC.6 60.96,40.64 63.5,40.64 64.77,41.91 66.04,41.91 FI_RES.P$1
  Bottom 0.457: FI_R2.1 64.77,52.07 60.96,52.07 FI_R1.2
N$17  (via drill 0.3)
  Top 0.457: 12.7,24.13 10.16,21.59 | v21.59,25.4 17.78,25.4 16.51,24.13 12.7,24.13 | 12.7,24.13 LFO_R3.2 | 10.16,21.59 10.16,19.05 12.7,16.51 LFO_IC.3 | 10.16,21.59 LFO_R4.1
  Bottom 0.457: v21.59,25.4 24.13,22.86 27.94,22.86 27.94,17.78 25.4,15.24 LFO_R5.1
N$18  (via drill 0.3)
  Top 0.457: 21.59,31.75 VCO_R3.1 24.13,34.29 VCO_*A.1 21.59,40.64 17.78,40.64 | v6.35,39.37 6.35,43.18 8.89,45.72 VCO_C1.1 | 17.78,40.64 VCO_IC.5 12.7,36.83 10.16,39.37 VCO_PITCH.P$2 | VCO_IC.2 17.78,40.64
  Bottom 0.457: VCO_PITCH.P$2 v6.35,39.37
N$19  (via drill 0.3)
  Top 0.457: v20.32,66.04 20.32,71.12 21.59,72.39 | INL1.1 21.59,72.39 | 21.59,72.39 INL.1
  Bottom 0.457: v20.32,66.04 26.67,66.04 26.67,57.15 24.13,54.61 INL_C.1
N$20
  Top 0.457: INL_C.2 20.32,50.8 15.24,50.8 15.24,63.5 11.43,67.31 11.43,68.58 13.97,71.12 13.97,72.39 12.7,73.66 6.35,73.66 6.35,69.85 3.81,67.31 3.81,64.77 IN.TIP
N$21
  Top 0.457: 20.32,20.32 16.51,20.32 | LFO_B.1 20.32,20.32 | 20.32,20.32 20.32,19.05 22.86,16.51 22.86,12.7 20.32,10.16 LFO_R5.2 | 16.51,20.32 16.51,12.7 8.89,12.7 LFO_PITCH.P$3 | 16.51,20.32 LFO_IC.1
N$22  (via drill 0.3)
  Top 0.457: 13.97,19.05 13.97,21.59 15.24,22.86 19.05,22.86 20.32,24.13 21.59,24.13 21.59,22.86 22.86,21.59 22.86,20.32 LFO_A.1 | LFO_IC.5 15.24,10.16 13.97,10.16 12.7,11.43 10.16,11.43 LFO_PITCH.P$2 10.16,10.16 8.89,10.16 2.54,16.51 LFO_C.1 | v13.97,13.97 13.97,19.05 | 13.97,19.05 LFO_IC.2
  Bottom 0.457: v13.97,13.97 11.43,11.43 10.16,11.43 LFO_PITCH.P$2
N$23  (via drill 0.3)
  Top 0.457: VCO_IC.6 VCO_IC.7 20.32,38.1 v20.32,39.37 | VCO1.1 VCO.1 | v25.4,43.18 24.13,44.45 24.13,52.07 v25.4,53.34
  Bottom 0.457: v20.32,39.37 24.13,43.18 v25.4,43.18 | v25.4,53.34 27.94,55.88 VCO.1
N$24
  Top 0.457: OUTR_C1.2 66.04,62.23 71.12,62.23 71.12,64.77 OUT.RING
N$25  (via drill 0.3)
  Top 0.457: ATTENUATION.1 57.15,25.4 57.15,30.48 58.42,31.75 FX_IC.2 52.07,41.91 52.07,46.99 v50.8,48.26 | v22.86,48.26 22.86,52.07 20.32,54.61 20.32,60.96 19.05,62.23 INR_R1.2
  Bottom 0.457: v50.8,48.26 v22.86,48.26
N$26  (via drill 0.3)
  Top 0.457: PWM_OUT1.1 PWM_OUT.1 | v53.34,35.56 FX_IC.1 55.88,33.02 v57.15,31.75 | v22.86,45.72 20.32,45.72 19.05,44.45 v17.78,45.72 | v62.23,46.99 v62.23,50.8 | v68.58,45.72 69.85,44.45 69.85,31.75 67.31,29.21 62.23,29.21 62.23,30.48 v59.69,33.02
  Bottom 0.457: v53.34,35.56 52.07,36.83 33.02,36.83 29.21,40.64 29.21,45.72 v22.86,45.72 | v17.78,45.72 17.78,48.26 15.24,50.8 15.24,58.42 11.43,58.42 INR_R2.1 | PWM_OUT.1 43.18,67.31 46.99,67.31 49.53,64.77 50.8,64.77 59.69,55.88 59.69,50.8 v62.23,50.8 | v62.23,46.99 63.5,48.26 66.04,48.26 v68.58,45.72 | v59.69,33.02 58.42,31.75 v57.15,31.75
TRIANGLE_PITCHMOD  (via drill 0.3)
  Top 0.457: VCO~1.1 VCO~.1 | v25.4,34.29 25.4,30.48 20.32,30.48 19.05,31.75 16.51,31.75 VCO_DIODE.A | v25.4,52.07 v25.4,44.45
  Bottom 0.457: v25.4,34.29 27.94,36.83 27.94,44.45 v25.4,44.45 | v25.4,52.07 30.48,57.15 VCO~.1
VIN  (via drill 0.3)
  Top 0.457: 10.16,29.21 8.89,27.94 8.89,24.13 5.08,24.13 LFO_R3.1 | 10.16,29.21 v17.78,29.21 19.05,29.21 24.13,24.13 v24.13,17.78 | VCO_IC.8 v20.32,31.75 | v13.97,48.26 7.62,48.26 6.35,46.99 v6.35,44.45 | v7.62,33.02 10.16,30.48 10.16,29.21 | FX_IC.8 55.88,46.99 FI_R1.1 | 72.39,19.05 73.66,17.78 73.66,11.43 LED_SW.1 | 72.39,19.05 71.12,20.32 | 71.12,20.32 71.12,24.13 68.58,26.67 PWM_R1.1 | 71.12,20.32 SW1.3 | 72.39,19.05 67.31,13.97 67.31,12.7 63.5,12.7 P_LED.P$2 | v53.34,38.1 52.07,36.83 52.07,30.48 | 52.07,30.48 52.07,26.67 55.88,22.86 63.5,22.86 v66.04,25.4 | 52.07,30.48 v50.8,30.48
  Bottom 0.457: v20.32,31.75 19.05,30.48 | 19.05,30.48 v17.78,29.21 | v24.13,17.78 21.59,15.24 LFO_IC.8 | v13.97,48.26 13.97,52.07 VCO_R1.1 | v6.35,44.45 6.35,41.91 3.81,39.37 6.35,36.83 6.35,33.02 v7.62,33.02 | FX_IC.8 55.88,40.64 v53.34,38.1 | v66.04,25.4 67.31,26.67 68.58,26.67 PWM_R1.1 | 19.05,30.48 21.59,27.94 33.02,27.94 35.56,30.48 v50.8,30.48

### Text on the board
tValues: IN | OUT | FILTER | 50K | 200K+ | PWM | VCO | PWM~+/- | Power | OP- / SYNTH | LED | 50K | LFO
bValues: circuit : thomas o fredericks / illustration : denis raby / op-synth.tofstuff.com | 9V battery
Reference: Use eagle 6.6 to export!